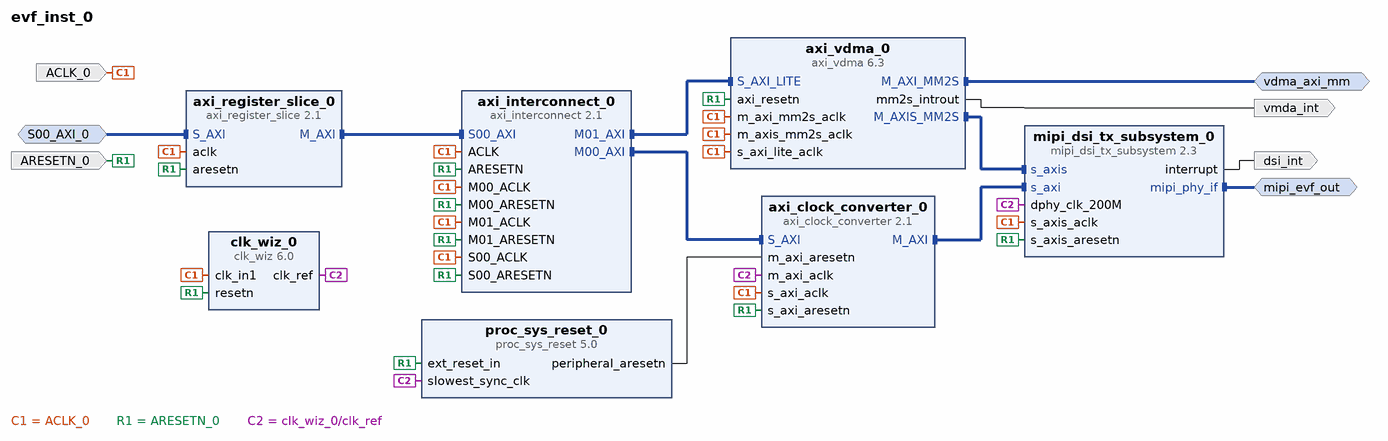
[diagram p0: block diagram of the top level]
# Vivado block design evf_inst_0, xc7z020clg484-2, Vivado 2023.2
create_bd_design evf_inst_0

create_bd_intf_port -mode Master -vlnv xilinx.com:interface:mipi_phy_rtl:1.0 mipi_evf_out
create_bd_intf_port -mode Slave -vlnv xilinx.com:interface:aximm_rtl:1.0 S00_AXI_0
create_bd_intf_port -mode Master -vlnv xilinx.com:interface:aximm_rtl:1.0 vdma_axi_mm
create_bd_port -dir I -type clk ACLK_0
create_bd_port -dir I -type rst ARESETN_0
create_bd_port -dir O -type intr vmda_int
create_bd_port -dir O -type intr dsi_int

create_bd_cell -type ip -vlnv xilinx.com:ip:mipi_dsi_tx_subsystem:2.3 mipi_dsi_tx_subsystem_0
set_property -dict [list \
  CONFIG.C_EN_7S_LINERATE_CHECK false \
  CONFIG.C_EN_HS_OBUFTDS false \
  CONFIG.C_INCLUDE_DCS_CMD_MODE true \
  CONFIG.DPHY_EN_REG_IF false \
  CONFIG.DSI_LANES 4 \
  CONFIG.DSI_PIXELS 4 \
  CONFIG.SupportLevel 1 \
] [get_bd_cells mipi_dsi_tx_subsystem_0]
create_bd_cell -type ip -vlnv xilinx.com:ip:axi_vdma:6.3 axi_vdma_0
set_property -dict [list \
  CONFIG.c_include_s2mm 0 \
  CONFIG.c_m_axi_mm2s_data_width 128 \
  CONFIG.c_m_axis_mm2s_tdata_width 96 \
  CONFIG.c_mm2s_genlock_mode 0 \
  CONFIG.c_mm2s_max_burst_length 256 \
  CONFIG.c_num_fstores 1 \
  CONFIG.c_use_mm2s_fsync 0 \
] [get_bd_cells axi_vdma_0]
create_bd_cell -type ip -vlnv xilinx.com:ip:axi_interconnect:2.1 axi_interconnect_0
create_bd_cell -type ip -vlnv xilinx.com:ip:clk_wiz:6.0 clk_wiz_0
set_property -dict [list \
  CONFIG.CLKOUT1_JITTER 114.829 \
  CONFIG.CLKOUT1_REQUESTED_OUT_FREQ 200.000 \
  CONFIG.CLK_OUT1_PORT clk_ref \
  CONFIG.MMCM_CLKOUT0_DIVIDE_F 5.000 \
  CONFIG.RESET_PORT resetn \
  CONFIG.RESET_TYPE ACTIVE_LOW \
  CONFIG.USE_LOCKED false \
] [get_bd_cells clk_wiz_0]
create_bd_cell -type ip -vlnv xilinx.com:ip:proc_sys_reset:5.0 proc_sys_reset_0
create_bd_cell -type ip -vlnv xilinx.com:ip:axi_clock_converter:2.1 axi_clock_converter_0
create_bd_cell -type ip -vlnv xilinx.com:ip:axi_register_slice:2.1 axi_register_slice_0

# ---- connections ----

connect_bd_intf_net -intf_net S00_AXI_0_1 [get_bd_intf_ports S00_AXI_0] [get_bd_intf_pins axi_register_slice_0/S_AXI]
connect_bd_intf_net [get_bd_intf_pins axi_clock_converter_0/M_AXI] [get_bd_intf_pins mipi_dsi_tx_subsystem_0/s_axi]
connect_bd_intf_net [get_bd_intf_pins axi_clock_converter_0/S_AXI] [get_bd_intf_pins axi_interconnect_0/M00_AXI]
connect_bd_intf_net [get_bd_intf_pins axi_interconnect_0/M01_AXI] [get_bd_intf_pins axi_vdma_0/S_AXI_LITE]
connect_bd_intf_net [get_bd_intf_pins axi_register_slice_0/M_AXI] [get_bd_intf_pins axi_interconnect_0/S00_AXI]
connect_bd_intf_net [get_bd_intf_pins axi_vdma_0/M_AXIS_MM2S] [get_bd_intf_pins mipi_dsi_tx_subsystem_0/s_axis]
connect_bd_intf_net [get_bd_intf_ports vdma_axi_mm] [get_bd_intf_pins axi_vdma_0/M_AXI_MM2S]
connect_bd_intf_net [get_bd_intf_ports mipi_evf_out] [get_bd_intf_pins mipi_dsi_tx_subsystem_0/mipi_phy_if]
connect_bd_net -net ACLK_0_1 [get_bd_ports ACLK_0] \
  [get_bd_pins axi_interconnect_0/ACLK] [get_bd_pins axi_vdma_0/m_axis_mm2s_aclk] \
  [get_bd_pins mipi_dsi_tx_subsystem_0/s_axis_aclk] [get_bd_pins axi_vdma_0/m_axi_mm2s_aclk] \
  [get_bd_pins axi_vdma_0/s_axi_lite_aclk] [get_bd_pins axi_interconnect_0/M01_ACLK] \
  [get_bd_pins axi_interconnect_0/S00_ACLK] [get_bd_pins clk_wiz_0/clk_in1] [get_bd_pins axi_interconnect_0/M00_ACLK] \
  [get_bd_pins axi_clock_converter_0/s_axi_aclk] [get_bd_pins axi_register_slice_0/aclk]
connect_bd_net -net ARESETN_0_1 [get_bd_ports ARESETN_0] \
  [get_bd_pins axi_interconnect_0/ARESETN] [get_bd_pins axi_interconnect_0/M01_ARESETN] [get_bd_pins axi_vdma_0/axi_resetn] \
  [get_bd_pins axi_interconnect_0/S00_ARESETN] [get_bd_pins mipi_dsi_tx_subsystem_0/s_axis_aresetn] \
  [get_bd_pins clk_wiz_0/resetn] [get_bd_pins proc_sys_reset_0/ext_reset_in] [get_bd_pins axi_interconnect_0/M00_ARESETN] \
  [get_bd_pins axi_clock_converter_0/s_axi_aresetn] [get_bd_pins axi_register_slice_0/aresetn]
connect_bd_net [get_bd_pins axi_vdma_0/mm2s_introut] [get_bd_ports vmda_int]
connect_bd_net [get_bd_pins clk_wiz_0/clk_ref] \
  [get_bd_pins mipi_dsi_tx_subsystem_0/dphy_clk_200M] [get_bd_pins proc_sys_reset_0/slowest_sync_clk] \
  [get_bd_pins axi_clock_converter_0/m_axi_aclk]
connect_bd_net [get_bd_pins mipi_dsi_tx_subsystem_0/interrupt] [get_bd_ports dsi_int]
connect_bd_net [get_bd_pins proc_sys_reset_0/peripheral_aresetn] [get_bd_pins axi_clock_converter_0/m_axi_aresetn]

# ---- address map ----
assign_bd_address -offset 0x00000000 -range 2M -target_address_space [get_bd_addr_spaces axi_vdma_0/Data_MM2S] [get_bd_addr_segs vdma_axi_mm/Reg]
assign_bd_address -offset 0x43000000 -range 64K -target_address_space [get_bd_addr_spaces S00_AXI_0] [get_bd_addr_segs axi_vdma_0/S_AXI_LITE/Reg]
assign_bd_address -offset 0x43C00000 -range 64K -target_address_space [get_bd_addr_spaces S00_AXI_0] [get_bd_addr_segs mipi_dsi_tx_subsystem_0/s_axi/Reg]

validate_bd_design
save_bd_design
